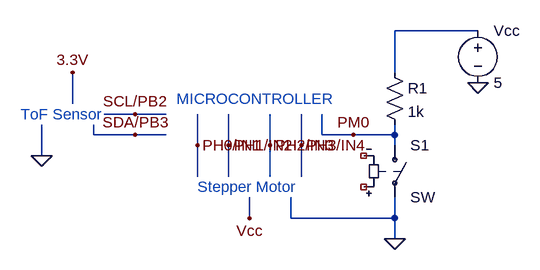
[diagram p0: schematic Circuit Scehmatic.asc]
Circuit Scehmatic.asc, the LTspice schematic file:
Version 4
SHEET 1 880 680
WIRE 560 16 432 16
WIRE 432 80 432 16
WIRE -64 128 -64 80
WIRE 32 144 -16 144
WIRE 80 144 32 144
WIRE -32 176 -32 160
WIRE 32 176 -32 176
WIRE 80 176 32 176
WIRE 320 176 320 144
WIRE 368 176 320 176
WIRE 432 176 432 160
WIRE 432 176 368 176
WIRE 128 192 128 144
WIRE 176 192 176 144
WIRE 240 192 240 144
WIRE 288 192 288 144
WIRE 432 192 432 176
WIRE -112 208 -112 160
WIRE 128 240 128 192
WIRE 176 240 176 192
WIRE 240 240 240 192
WIRE 288 240 288 192
WIRE 208 304 208 272
WIRE 272 304 272 272
WIRE 432 304 432 272
WIRE 432 304 272 304
WIRE 432 336 432 304
FLAG 32 144 SCL/PB2
FLAG 32 176 SDA/PB3
FLAG 368 176 PM0
FLAG 432 336 0
FLAG 560 96 0
FLAG 128 192 PH0/IN1
FLAG 176 192 PH1/IN2
FLAG 240 192 PH2/IN3
FLAG 288 192 PH3/IN4
FLAG 208 304 Vcc
FLAG -112 208 0
FLAG -64 80 3.3V
SYMBOL res 416 64 R0
SYMATTR InstName R1
SYMATTR Value 1k
SYMBOL sw 432 176 R0
SYMATTR InstName S1
SYMBOL voltage 560 0 R0
WINDOW 123 0 0 Left 0
WINDOW 39 0 0 Left 0
SYMATTR InstName Vcc
SYMATTR Value 5
TEXT 96 120 Left 2 ;MICROCONTROLLER
TEXT 128 256 Left 2 ;Stepper Motor
TEXT -144 144 Left 2 ;ToF Sensor

The netlist it stands for:
* Circuit Scehmatic.asc
R1 N001 PM0 1k
S1 PM0 0 NC_01 NC_02 SW
Vcc N001 0 5
* MICROCONTROLLER
* Stepper Motor
* ToF Sensor
.backanno
.end